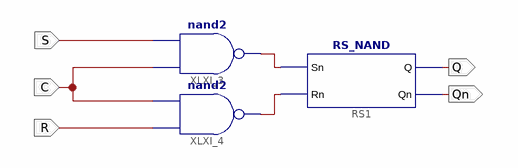
[diagram p0: schematic sheet 1]
// Xilinx ISE schematic RS_EN.sch (kintex7) as structural Verilog: 3 symbols, 5 ports
module RS_EN (
  input  S,
  input  C,
  input  R,
  output Q,
  output Qn
);

  wire XLXN_5, XLXN_6;

  RS_NAND RS1 (.Sn(XLXN_5), .Rn(XLXN_6), .Q(Q), .Qn(Qn));
  nand XLXI_3 (XLXN_5, C, S);
  nand XLXI_4 (XLXN_6, R, C);
endmodule
